# Altium schematic sheet MCU Header.SchDoc: Nucleo Header Pin Assignment
size B; Date: 24-01-27; CheckedBy: Jude Thibeault; Author: Kyle Dick; DrawnBy: Kyle Dick; Engineer: Kyle Dick; Revision: 3; SheetNumber: 4; SheetTotal: 11
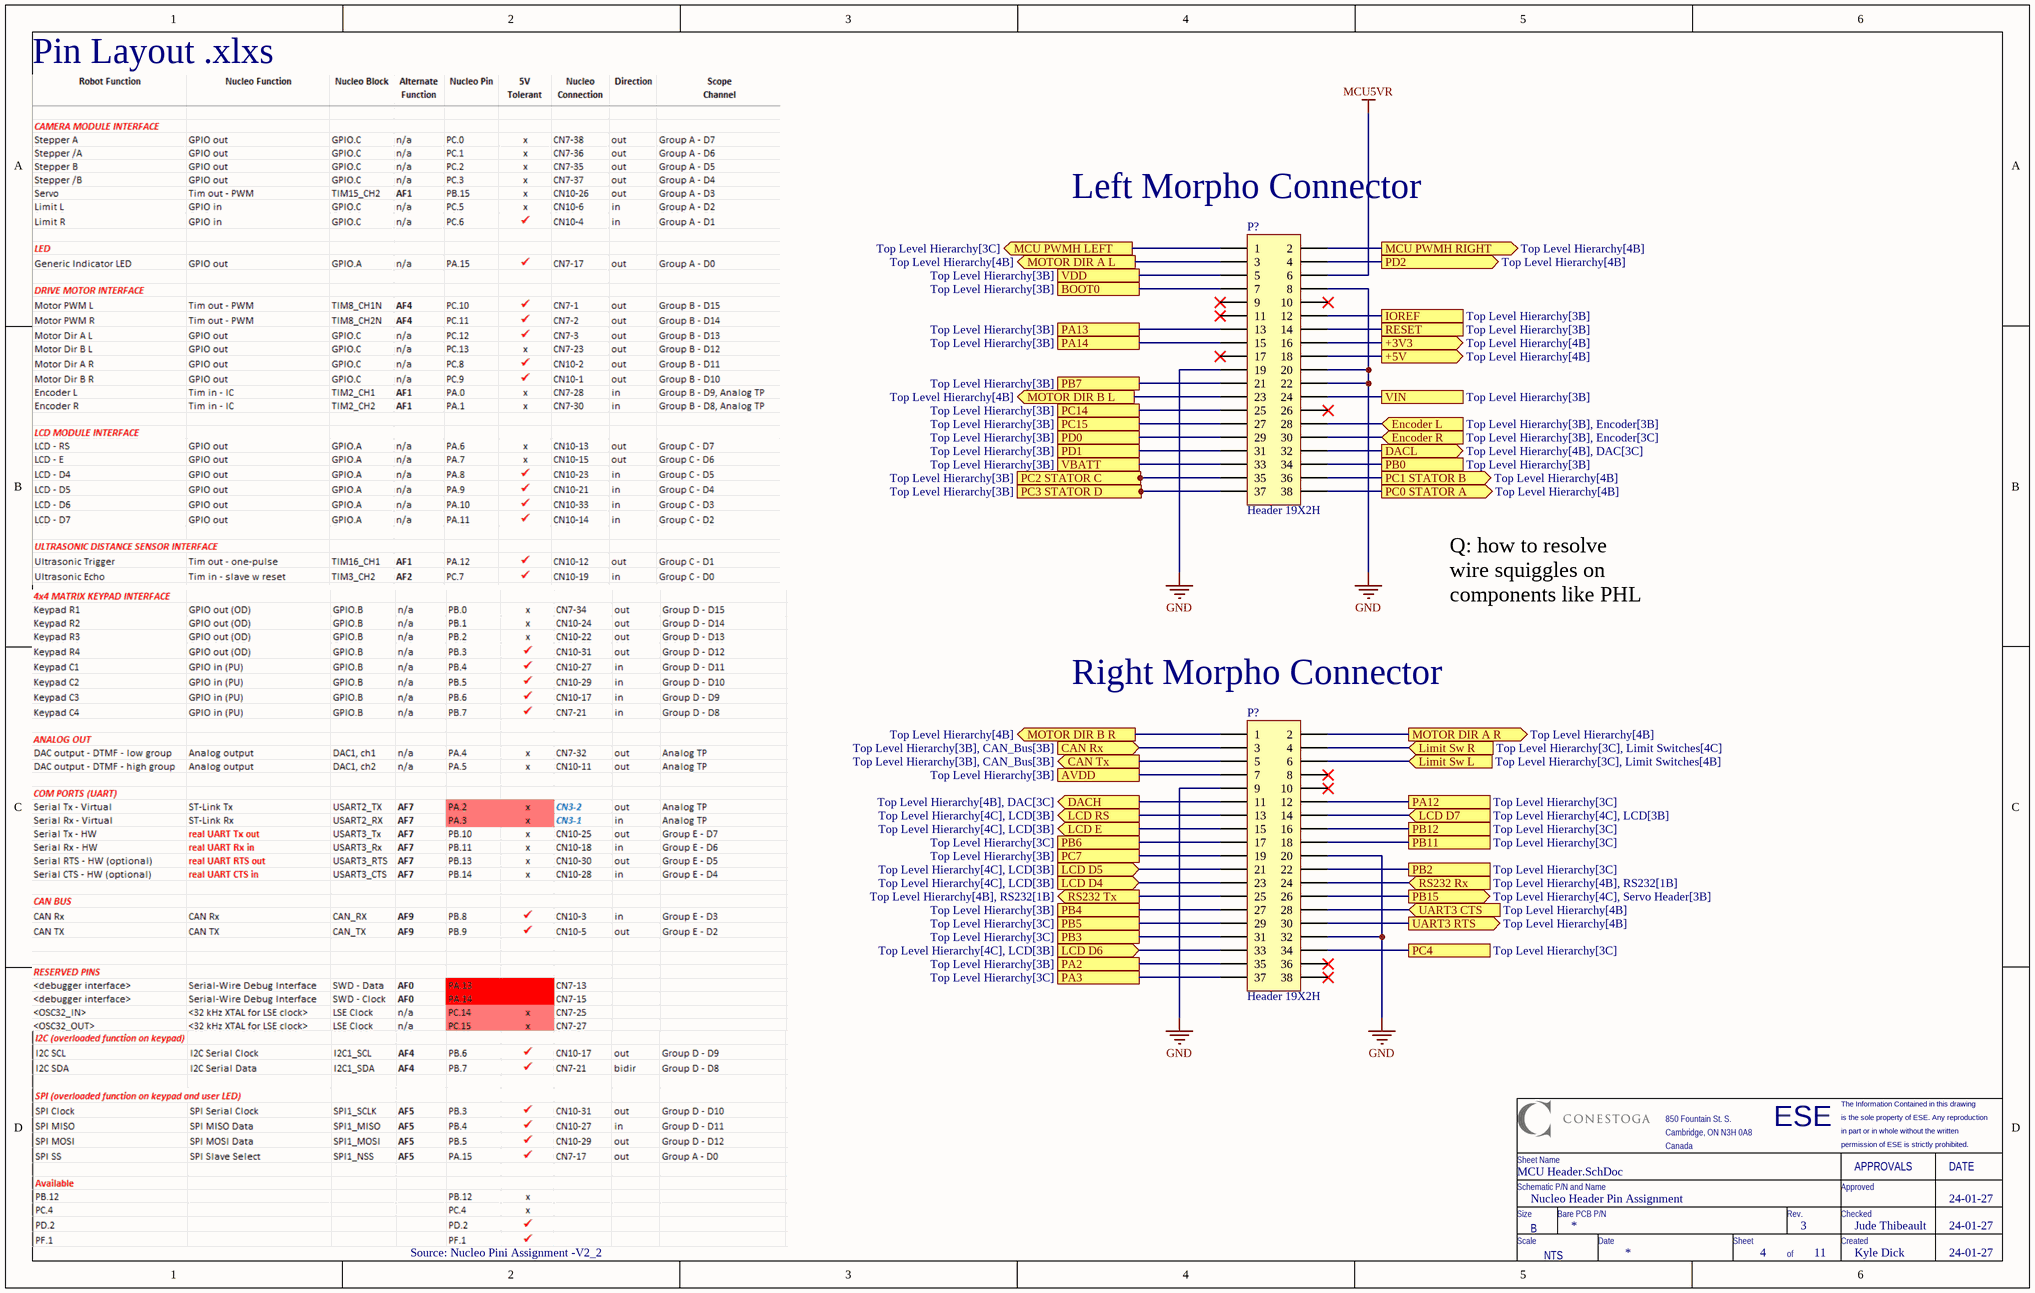
[diagram p0: MCU Header.SchDoc]

## Parts
(Parts that share a designator on the sheet are numbered #1, #2 ... from top to bottom, then left to right.)
P?#1  Header 19X2H  [Model Name]
P?#2  Header 19X2H  [PPPC192LFBN-RC]

## Ports
+3V3 (out, see Top Level Hierarchy[4B]), +5V (out, see Top Level Hierarchy[4B]), AVDD (see Top Level Hierarchy[3B]), BOOT0 (see Top Level Hierarchy[3B]), CAN Rx (in, see Top Level Hierarchy[3B], CAN_Bus[3B]), CAN Tx (out, see Top Level Hierarchy[3B], CAN_Bus[3B]), DACH (out, see Top Level Hierarchy[4B], DAC[3C]), DACL (out, see Top Level Hierarchy[4B], DAC[3C]), Encoder L (in, see Top Level Hierarchy[3B], Encoder[3B]), Encoder R (in, see Top Level Hierarchy[3B], Encoder[3C]), IOREF (see Top Level Hierarchy[3B]), LCD D4 (in, see Top Level Hierarchy[4C], LCD[3B]), LCD D5 (in, see Top Level Hierarchy[4C], LCD[3B]), LCD D6 (in, see Top Level Hierarchy[4C], LCD[3B]), LCD D7 (in, see Top Level Hierarchy[4C], LCD[3B]), LCD E (out, see Top Level Hierarchy[4C], LCD[3B]), LCD RS (out, see Top Level Hierarchy[4C], LCD[3B]), Limit Sw L (in, see Top Level Hierarchy[3C], Limit Switches[4B]), Limit Sw R (in, see Top Level Hierarchy[3C], Limit Switches[4C]), MCU PWMH LEFT (out, see Top Level Hierarchy[3C]), MCU PWMH RIGHT (out, see Top Level Hierarchy[4B]), MOTOR DIR A L (out, see Top Level Hierarchy[4B]), MOTOR DIR A R (out, see Top Level Hierarchy[4B]), MOTOR DIR B L (out, see Top Level Hierarchy[4B]), MOTOR DIR B R (out, see Top Level Hierarchy[4B]), PA2 (see Top Level Hierarchy[3B]), PA3 (see Top Level Hierarchy[3C]), PA12 (see Top Level Hierarchy[3C]), PA13 (see Top Level Hierarchy[3B]), PA14 (see Top Level Hierarchy[3B]), PB0 (see Top Level Hierarchy[3B]), PB2 (see Top Level Hierarchy[3C]), PB3 (see Top Level Hierarchy[3C]), PB4 (see Top Level Hierarchy[3B]), PB5 (see Top Level Hierarchy[3C]), PB6 (see Top Level Hierarchy[3C]), PB7 (see Top Level Hierarchy[3B]), PB11 (see Top Level Hierarchy[3C]), PB12 (see Top Level Hierarchy[3C]), PB15 (out, see Top Level Hierarchy[4C], Servo Header[3B]), PC0 STATOR A (out, see Top Level Hierarchy[4B]), PC1 STATOR B (out, see Top Level Hierarchy[4B]), PC2 STATOR C (out, see Top Level Hierarchy[3B]), PC3 STATOR D (out, see Top Level Hierarchy[3B]), PC4 (see Top Level Hierarchy[3C]), PC7 (see Top Level Hierarchy[3B]), PC14 (see Top Level Hierarchy[3B]), PC15 (see Top Level Hierarchy[3B]), PD0 (see Top Level Hierarchy[3B]), PD1 (see Top Level Hierarchy[3B]), PD2 (out, see Top Level Hierarchy[4B]), RESET (see Top Level Hierarchy[3B]), RS232 Rx (in, see Top Level Hierarchy[4B], RS232[1B]), RS232 Tx (out, see Top Level Hierarchy[4B], RS232[1B]), UART3 CTS (in, see Top Level Hierarchy[4B]), UART3 RTS (out, see Top Level Hierarchy[4B]), VBATT (see Top Level Hierarchy[3B]), VDD (see Top Level Hierarchy[3B]), VIN (see Top Level Hierarchy[3B])

## Nets
GND: P?#1.8 P?#1.19 P?#1.20 P?#1.22 P?#2.9 P?#2.20 P?#2.32
MCU5VR: P?#1.6
+3V3: P?#1.16 ; port +3V3
+5V: P?#1.18 ; port +5V
AVDD: P?#2.7 ; port AVDD
BOOT0: P?#1.7 ; port BOOT0
CAN Rx: P?#2.3 ; port CAN Rx
CAN Tx: P?#2.5 ; port CAN Tx
DACH: P?#2.11 ; port DACH
DACL: P?#1.32 ; port DACL
Encoder L: P?#1.28 ; port Encoder L
Encoder R: P?#1.30 ; port Encoder R
IOREF: P?#1.12 ; port IOREF
LCD D4: P?#2.23 ; port LCD D4
LCD D5: P?#2.21 ; port LCD D5
LCD D6: P?#2.33 ; port LCD D6
LCD D7: P?#2.14 ; port LCD D7
LCD E: P?#2.15 ; port LCD E
LCD RS: P?#2.13 ; port LCD RS
Limit Sw L: P?#2.6 ; port Limit Sw L
Limit Sw R: P?#2.4 ; port Limit Sw R
MCU PWMH LEFT: P?#1.1 ; port MCU PWMH LEFT
MCU PWMH RIGHT: P?#1.2 ; port MCU PWMH RIGHT
MOTOR DIR A L: P?#1.3 ; port MOTOR DIR A L
MOTOR DIR A R: P?#2.2 ; port MOTOR DIR A R
MOTOR DIR B L: P?#1.23 ; port MOTOR DIR B L
MOTOR DIR B R: P?#2.1 ; port MOTOR DIR B R
PA2: P?#2.35 ; port PA2
PA3: P?#2.37 ; port PA3
PA12: P?#2.12 ; port PA12
PA13: P?#1.13 ; port PA13
PA14: P?#1.15 ; port PA14
PB0: P?#1.34 ; port PB0
PB2: P?#2.22 ; port PB2
PB3: P?#2.31 ; port PB3
PB4: P?#2.27 ; port PB4
PB5: P?#2.29 ; port PB5
PB6: P?#2.17 ; port PB6
PB7: P?#1.21 ; port PB7
PB11: P?#2.18 ; port PB11
PB12: P?#2.16 ; port PB12
PB15: P?#2.26 ; port PB15
PC0 STATOR A: P?#1.38 ; port PC0 STATOR A
PC1 STATOR B: P?#1.36 ; port PC1 STATOR B
PC2 STATOR C: P?#1.35 ; port PC2 STATOR C
PC3 STATOR D: P?#1.37 ; port PC3 STATOR D
PC4: P?#2.34 ; port PC4
PC7: P?#2.19 ; port PC7
PC14: P?#1.25 ; port PC14
PC15: P?#1.27 ; port PC15
PD0: P?#1.29 ; port PD0
PD1: P?#1.31 ; port PD1
PD2: P?#1.4 ; port PD2
RESET: P?#1.14 ; port RESET
RS232 Rx: P?#2.24 ; port RS232 Rx
RS232 Tx: P?#2.25 ; port RS232 Tx
UART3 CTS: P?#2.28 ; port UART3 CTS
UART3 RTS: P?#2.30 ; port UART3 RTS
VBATT: P?#1.33 ; port VBATT
VDD: P?#1.5 ; port VDD
VIN: P?#1.24 ; port VIN

Not connected (* = marked no-connect by the designer): P?#1 9* 10* 11* 17* 26*; P?#2 8* 10* 36* 38*

## Notes on the sheet
- Pin Layout .xlxs
- (near P?#1) Left Morpho Connector
- Q: how to resolve wire squiggles on components like PHL
- (near P?#2) Right Morpho Connector
- Source: Nucleo Pini Assignment -V2_2
- ESE
- is the sole property of ESE. Any reproduction
- The Information Contained in this drawing
- Schematic P/N and Name
- Sheet Name
- 850 Fountain St. S.
- Cambridge, ON N3H 0A8
- Canada
- Approved
- in part or in whole without the written
- permission of ESE is strictly prohibited.
- APPROVALS
- DATE
- Size
- Scale
- B
- NTS
- Bare PCB P/N
- Date
- Sheet
- Rev.
- Checked
- Created
- of

## Library data of the parts
P?#1 = Header 19X2H: 38 Position Header Connector 0.100in (2.54mm) Through Hole Gold; MPN: PPPC192LFBN-RC; PN: S7122-ND; URL: https://www.digikey.ca/product-detail/en/sullins-connector-solutions/PPPC192LFBN-RC/S7122-ND
P?#2 = Header 19X2H: 38 Position Header Connector 0.100in (2.54mm) Through Hole Gold; PN: S7122-ND; URL: https://www.digikey.ca/product-detail/en/sullins-connector-solutions/PPPC192LFBN-RC/S7122-ND; MPN: PPPC192LFBN-RC